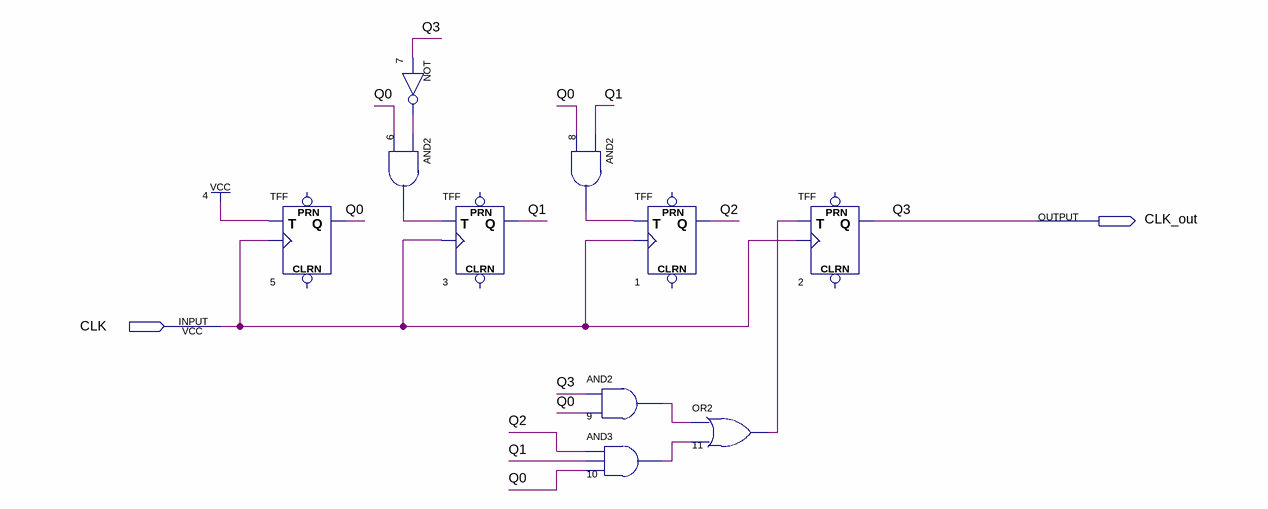
[diagram p0: schematic sheet]
// Quartus schematic div10_t.bdf as structural Verilog: 10 symbols, 2 pins
module div10_t (
  input  CLK,
  output CLK_out
);

  wire n6_out, n7_out, n8_out, n9_out, n10_out, n11_out, Q0, Q1, Q2;

  TFF u_5 (.T(1'b1), .CLK(CLK), .Q(Q0));  // open: PRN, CLRN
  not u_7 (n7_out, CLK_out);
  and u_6 (n6_out, n7_out, Q0);
  TFF u_3 (.T(n6_out), .CLK(CLK), .Q(Q1));  // open: PRN, CLRN
  and u_8 (n8_out, Q1, Q0);
  and u_9 (n9_out, CLK_out, Q0);
  and u_10 (n10_out, Q2, Q1, Q0);
  TFF u_1 (.T(n8_out), .CLK(CLK), .Q(Q2));  // open: PRN, CLRN
  or u_11 (n11_out, n9_out, n10_out);
  TFF u_2 (.T(n11_out), .CLK(CLK), .Q(CLK_out));  // open: PRN, CLRN

  // Other names for the same wires on the sheet: Q3 = CLK_out
endmodule
